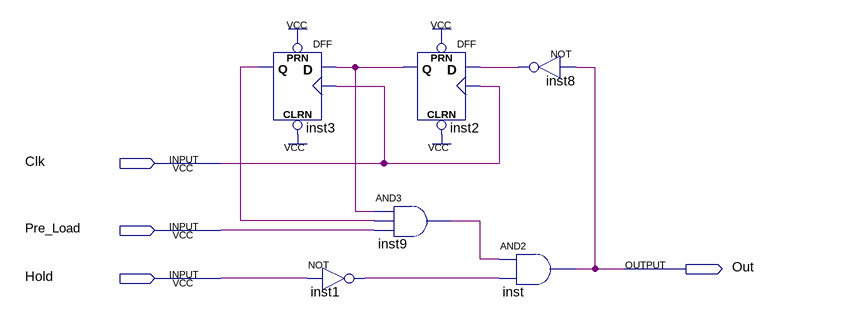
[diagram p0: schematic sheet]
// Quartus schematic Pre_Load_Retain.bdf as structural Verilog: 6 symbols, 4 pins
module Pre_Load_Retain (
  input  Clk,
  input  Pre_Load,
  input  Hold,
  output Out
);

  wire inst1_out, inst2_q, inst3_q, inst8_out, inst9_out;

  DFF inst3 (.CLRN(1'b1), .CLK(Clk), .D(inst2_q), .PRN(1'b1), .Q(inst3_q));
  not inst1 (inst1_out, Hold);
  DFF inst2 (.CLRN(1'b1), .CLK(Clk), .D(inst8_out), .PRN(1'b1), .Q(inst2_q));
  and inst9 (inst9_out, inst2_q, inst3_q, Pre_Load);
  not inst8 (inst8_out, Out);
  and inst (Out, inst9_out, inst1_out);
endmodule
